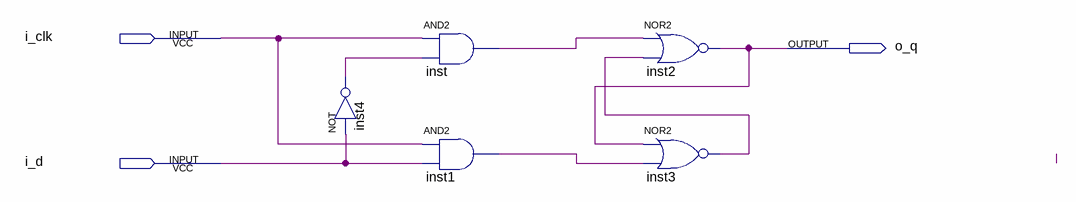
[diagram p0: schematic sheet]
// Quartus schematic orblatch_bdf.bdf as structural Verilog: 5 symbols, 3 pins
module orblatch_bdf (
  input  i_clk,
  input  i_d,
  output o_q
);

  wire inst1_out, inst3_out, inst4_out, inst_out;

  not inst4 (inst4_out, i_d);
  and inst (inst_out, i_clk, inst4_out);
  and inst1 (inst1_out, i_clk, i_d);
  nor inst2 (o_q, inst_out, inst3_out);
  nor inst3 (inst3_out, o_q, inst1_out);
endmodule
